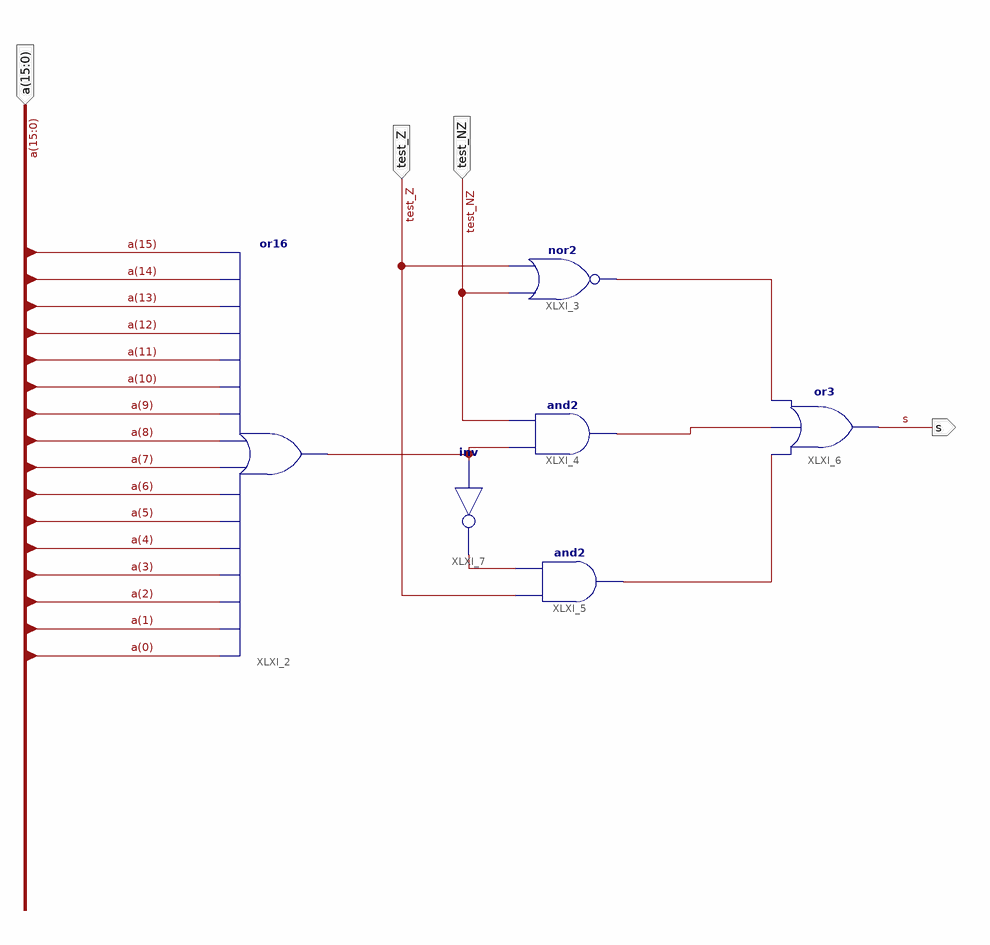
[diagram p0: schematic sheet 1]
// Xilinx ISE schematic testeur.sch (spartan3e) as structural Verilog: 6 symbols, 4 ports
module testeur (
  input  [15:0] a,
  input  test_NZ,
  input  test_Z,
  output s
);

  wire XLXN_18, XLXN_19, XLXN_22, XLXN_23, XLXN_24;

  or XLXI_2 (XLXN_19, a[0], a[1], a[2], a[3], a[4], a[5], a[6], a[7], a[8], a[9], a[10], a[11], a[12], a[13], a[14], a[15]);
  nor XLXI_3 (XLXN_22, test_NZ, test_Z);
  and XLXI_4 (XLXN_23, XLXN_19, test_NZ);
  and XLXI_5 (XLXN_24, test_Z, XLXN_18);
  or XLXI_6 (s, XLXN_24, XLXN_23, XLXN_22);
  not XLXI_7 (XLXN_18, XLXN_19);
endmodule
